# EAGLE design AS5040_SSI (EAGLE 7.2.0)
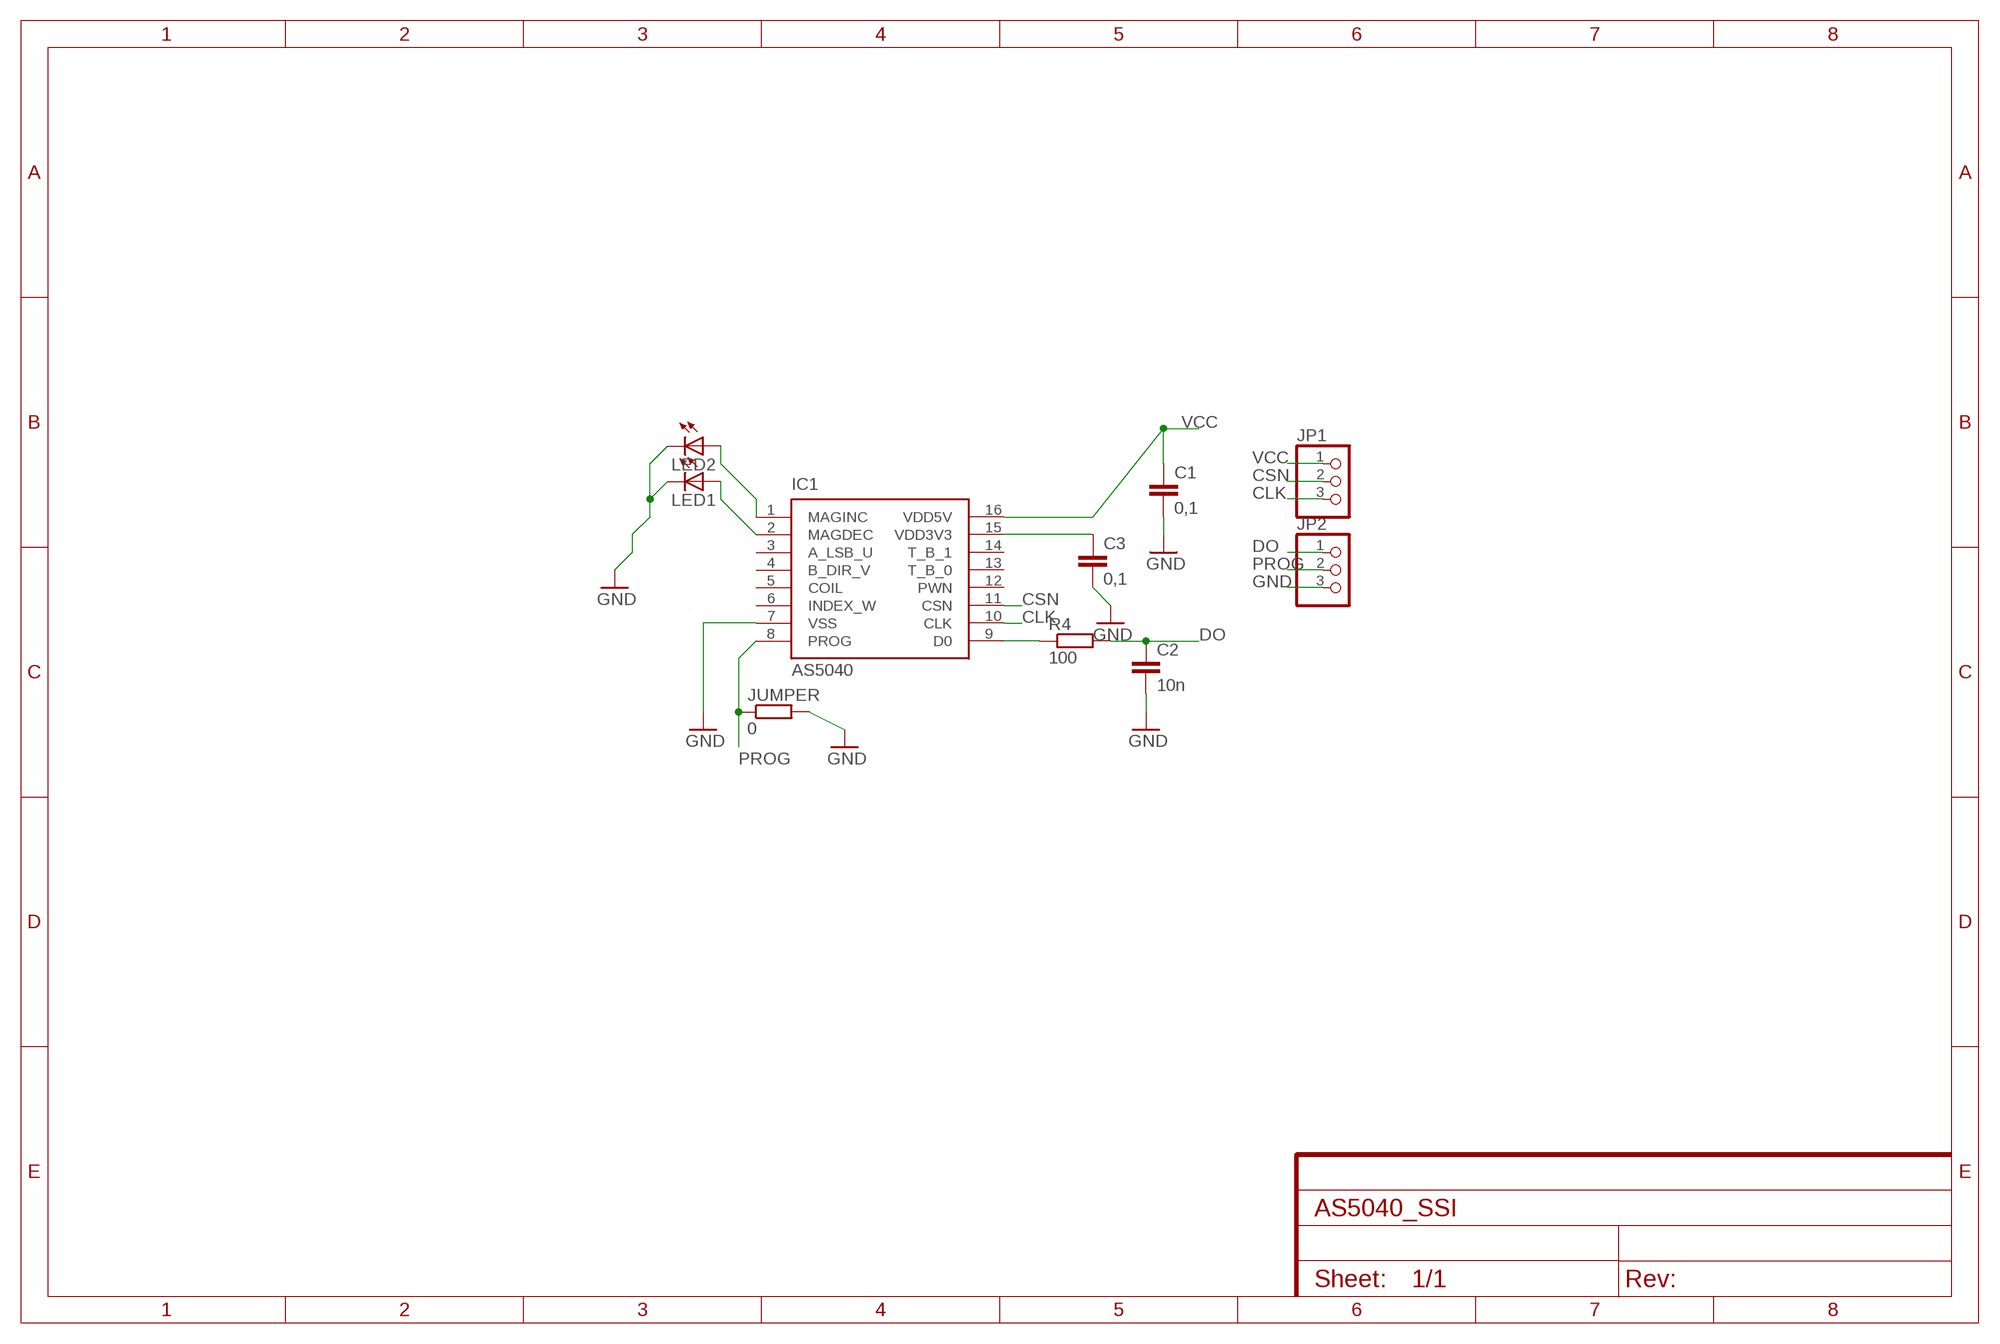
[diagram p0: schematic, sheet 1]

## Parts
C1  0,1  C-EUC0805  [C0805]
C2  10n  C-EUC0805  [C0805]
C3  0,1  C-EUC0805  [C0805]
IC1  AS5040  [SSOP16]
JP1  PINHD-1X3  [1X03]
JP2  PINHD-1X3  [1X03]
JUMPER  0  R-EU_M0805  [M0805]
LED1  LEDCHIPLED_0805  [CHIPLED_0805]
LED2  LEDCHIPLED_0805  [CHIPLED_0805]
R4  100  R-EU_M0805  [M0805]

## Nets
CLK: IC1.10(CLK) JP1.3
CSN: IC1.11(CSN) JP1.2
DO: C2.1 JP2.1 R4.2
GND: C1.2 C2.2 C3.2 IC1.7(VSS) JP2.3 JUMPER.2 LED1.C LED2.C
N$1: IC1.9(D0) R4.1
N$2: IC1.1(MAGINC) LED2.A
N$3: IC1.2(MAGDEC) LED1.A
N$4: C3.1 IC1.15(VDD3V3)
PROG: IC1.8(PROG) JP2.2 JUMPER.1
VCC: C1.1 IC1.16(VDD5V) JP1.1
Unconnected: IC1.3(A_LSB_U) IC1.4(B_DIR_V) IC1.5(COIL) IC1.6(INDEX_W) IC1.12(PWN) IC1.13(T_B_0) IC1.14(T_B_1)

## Library data of the parts
C1-C3 = rcl:C-EU: CAPACITOR, European symbol
IC1 = austriamicrosystems:AS5040: 10-BIT PROGRAMMABLE MAGNETIC ROTARY ENCODER Source: www.austriamicrosystems.com .. AS5040DataSheetRev12.pdf; MPN: AS5040ASSU; OC_FARNELL: 1630800; OC_NEWARK: 59P4059
JP1 JP2 = adafruit:PINHD-1X3: PIN HEADER
JUMPER R4 = resistor:R-EU_: RESISTOR, European symbol
LED1 LED2 = adafruit:LED: LED OSRAM: - CHIPLED LG R971, LG N971, LY N971, LG Q971, LY Q971, LO R971, LY R971 LH N974, LH R974 LS Q976, LO Q976, LY Q976 LO Q996 - Hyper CHIPLED LW Q18S LB Q993, LB Q99A, LB R99A - SideLED LS A670, LO A670, LY A670, LG A670, LP A670 LB A673, LV A673, LT A673, LW A673 LH A674 LY A675 LS A676, LA A676, LO A676, LY A676, LW A676 LS A679, LY A679, LG A679 - Hyper Micro SIDELED® LS Y876, LA Y876, LO Y876, LY Y876 LT Y87S - SmartLED LW L88C, LW L88S LB L89C, LB L89S, LG L890 LS L89K, LO L89K, LY L89K LS L896, LA L896, LO L896, LY L896 - TOPLED LS T670, LO T670, LY T670, LG T670, LP T670 LSG T670, LSP T670, LSY T670, LOP T670, LYG T670 LG T671, LOG T671, LSG T671 LB T673, LV T673, LT T673, LW T673 LH T674 LS T676, LA T676, LO T676, LY T676, LB T676, LH T676, LSB T676, LW T676 LB T67C, LV T67C, LT T67C, LS T67K, LO T67K, LY T67K, LW E67C LS E67B, LA E67B, LO E67B, LY E67B, LB E67C, LV E67C, LT E67C LW T67C LS T679, LY T679, LG T679 LS T770, LO T770, LY T770, LG T770, LP T770 LB T773, LV T773, LT T773, LW T773 LH T774 LS E675, LA E675, LY E675, LS T675 LS T776, LA T776, LO T776, LY T776, LB T776 LHGB T686 LT T68C, LB T68C - Hyper Mini TOPLED® LB M676 - Mini TOPLED Santana® LG M470 LS M47K, LO M47K, LY M47K Source: http://www.osram.convergy.de/

## Board
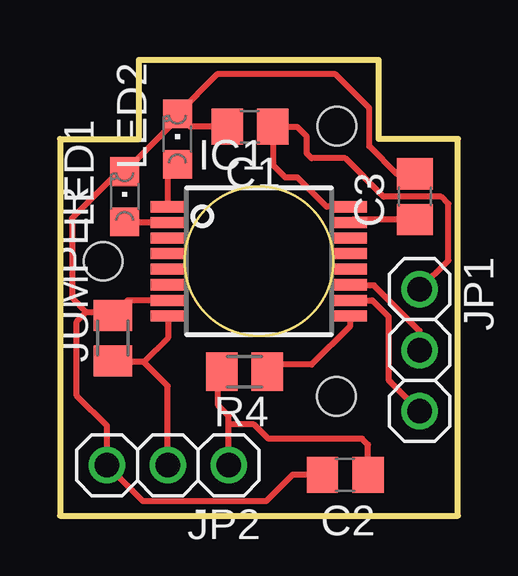
[diagram p1: board, top side]

Size 16.6 x 19 mm. Coordinates in mm from the lower left corner, seen from the top.
Outline: 0,15.7 3.3,15.7 3.3,19 13.3,19 13.3,15.7 16.6,15.7 16.6,0 0,0 0,15.7
Outline: circle at 8.3,10.6 radius 3.1
Copper layers (1*16): Top 0.035mm / dielectric 1.5mm / Bottom 0.035mm
Design rules "default": minimum track width 10mil, minimum drill 24mil, track to track 8mil, track to pad 8mil, pad to pad 8mil, via to via 8mil, smd to smd 8mil, copper to edge 40mil, drill to drill 8mil, minimum pad ring 10mil, minimum via ring 8mil, stop-mask expansion 4mil, vias tented up to drill 0mil, thermal gap 10mil
Holes 1.6 mm at 1.8,10.61 11.56,16.24 11.54,4.97

### Footprints (pad centres in the part's own frame; a part is rotated, then mirrored left to right if it is on the bottom)
C0805 = smd 1.3 x 1.5: 1 -0.95,0; 2 0.95,0
SSOP16 = smd 0.46 x 1.43: 1 -2.275,-3.795; 2 -1.625,-3.795; 3 -0.975,-3.795; 4 -0.325,-3.795; 5 0.325,-3.795; 6 0.975,-3.795; 7 1.625,-3.795; 8 2.275,-3.795; 9 2.275,3.795; 10 1.625,3.795; 11 0.975,3.795; 12 0.325,3.795; 13 -0.325,3.795; 14 -0.975,3.795; 15 -1.625,3.795; 16 -2.275,3.795
1X03 = drill 1.016: 1 -2.54,0; 2 0,0; 3 2.54,0
M0805 = smd 1.3 x 1.6: 1 -0.95,0; 2 0.95,0
CHIPLED_0805 = smd 1.2 x 1.2: A 0,-1.05; C 0,1.05

### Placement (x,y rotation side)
C1  7.93,16.21 180 top
C2  11.9,1.7 180 top
C3  14.8,13.3 90 top
IC1  8.3,10.6 270 top
JP1  15,6.9 270 top
JP2  4.5,2.1 180 top
JUMPER  2.2,7.4 90 top
LED1  2.7,13.3 0 top
LED2  4.9,15.7 0 top
R4  7.7,6 180 top

### Tracks (layer width: path | path; a pad name or v marks a point on that pad's centre or on a via)
CLK
  Top 0.254: IC1.10 13.03,8.98 13.7,8.3 13.7,5.66 JP1.3
CSN
  Top 0.254: JP1.2 15,7.7 13.1,9.6 12.12,9.6 IC1.11
DO
  Top 0.254: JP2.1 7.04,3.8 | R4.2 6.6,5.85 6.6,4.6 7.04,4.16 7.04,3.8 | C2.1 12.85,2.95 12.6,3.2 8.7,3.2 8.1,3.8 7.04,3.8
GND
  Top 0.254: C1.2 5.44,16.21 LED2.C | LED2.C 4.9,16.55 LED1.C 2.45,14.35 0.5,12.4 0.5,9.1 1.1,8.5 | IC1.7 2.82,8.98 JUMPER.2 2.05,8.5 1.1,8.5 | 1.1,8.5 0.7,8.1 0.7,5 1.96,3.74 JP2.3 3.46,0.6 8.6,0.6 9.7,1.7 C2.2 | C3.2 14.05,14.25 12.9,15.4 12.9,17 11.5,18.4 6.55,18.4 LED2.C
N$1
  Top 0.254: IC1.9 12.1,7.89 10.5,6.3 8.95,6.3 R4.1
N$2
  Top 0.254: IC1.1 4.5,14.25 LED2.A
N$3
  Top 0.254: LED1.A 4.48,12.25 IC1.2
N$4
  Top 0.254: C3.1 12.22,12.35 IC1.15
PROG
  Top 0.254: IC1.8 4.5,7.41 3.5,6.4 | 3.5,6.4 2.25,6.4 JUMPER.1 | JP2.2 4.5,5.4 3.5,6.4
VCC
  Top 0.254: IC1.16 11.12,12.88 9.9,14.1 9.4,14.1 8.9,14.6 8.9,16.19 C1.1 9.9,16.2 10.3,15.8 10.3,15.1 10.5,14.9 11.9,14.9 13.5,13.3 15.9,13.3 16.2,13 16.2,10.64 JP1.1